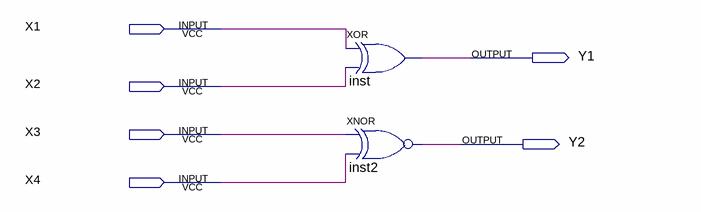
[diagram p0: schematic sheet]
// Quartus schematic lab1-1.bdf as structural Verilog: 2 symbols, 6 pins
module \lab1-1  (
  input  X1,
  input  X2,
  input  X3,
  input  X4,
  output Y1,
  output Y2
);

  xor inst (Y1, X1, X2);
  xnor inst2 (Y2, X3, X4);
endmodule
